# Altium schematic sheet Triggers.SchDoc
size A4
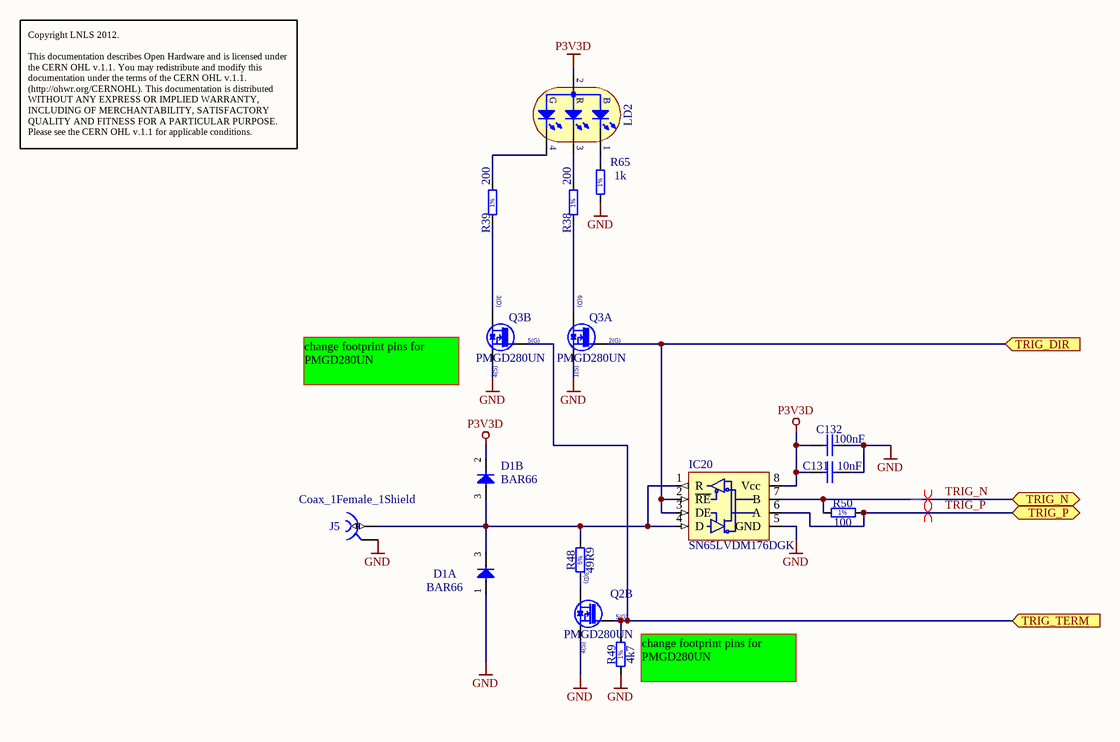
[diagram p0: Triggers.SchDoc]

## Parts
C131  10nF  [CAPC0603X33N]
C132  100nF  [CAPC0603X33N]
D1  BAR66  [SOT95P240X110-3I]  (parts A,B of 2)
IC20  SN65LVDM176DGK  [SOP65P490X110-8N]
J5  Coax_1Female_1Shield  [HUBER-SUHNER_85_MMCX-50-0-1/111 OH]
LD2  (no value)  [LED_AVAGO_HSMF-C113]
Q2  PMGD280UN  [SOT65P210X110-6N]  (part B of 2)
Q3  PMGD280UN  [SOT65P210X110-6N]  (parts A,B of 2)
R38  200  [RESC1005X40N]
R39  200  [RESC1005X40N]
R48  49R9  [RESC3225X70N]
R49  4k7  [RESC1005X40N]
R50  100  [RESC1005X40N]
R65  1k  [RESC1005X40N]

## Ports
TRIG_DIR (in), TRIG_N (bidir), TRIG_P (bidir), TRIG_TERM (in)

## Nets
GND: C131.2 C132.2 D1.1(A) IC20.5(GND) J5.2 Q2.4(S) Q3.1(S) Q3.4(S) R49.1 R65.1
P3V3D: C131.1 C132.1 D1.2(C) IC20.8(Vcc) LD2.2(AC)
TRIG_DIR: IC20.2(~{RE}) IC20.3(DE) Q3.2(G) ; port TRIG_DIR
TRIG_N: IC20.7(B) R50.1 ; port TRIG_N
TRIG_P: IC20.6(A) R50.2 ; port TRIG_P
TRIG_TERM: Q2.5(G) Q3.5(G) R49.2 ; port TRIG_TERM
NetD1_3: D1.3(COMAC) IC20.1(R) IC20.4(D) J5.1 R48.2
NetLD2_1: LD2.1(CB) R65.2
NetLD2_3: LD2.3(CR) R38.2
NetLD2_4: LD2.4(CG) R39.2
NetQ2_3: Q2.3(D) R48.1
NetQ3_3: Q3.3(D) R39.1
NetQ3_6: Q3.6(D) R38.1

## Layout directives
differential pair: TRIG_N, TRIG_P

## Notes on the sheet
- Copyright LNLS 2012.
  This documentation describes Open Hardware and is licensed under the CERN OHL v.1.1. You may redistribute and modify this documentation under the terms of the CERN OHL v.1.1. (http://ohwr.org/CERNOHL). This documentation is distributed WITHOUT ANY EXPRESS OR IMPLIED WARRANTY, INCLUDING OF MERCHANTABILITY, SATISFACTORY QUALITY AND FITNESS FOR A PARTICULAR PURPOSE. Please see the CERN OHL v.1.1 for applicable conditions.
- (near Q3) change footprint pins for PMGD280UN
- (near R49) change footprint pins for PMGD280UN
- (in symbol LED_AVAGO_HSMF-C113) G; R; B
- (in symbol PMGD280UN, part A) 6(D); 2(G); 1(S)
- (in symbol PMGD280UN, part B) 3(D); 5(G); 4(S)
- (in symbol R0402_1K_1%_0.0625W_100PPM) 1%
- (in symbol R0402_4K7_1%_0.0625W_100PPM) 1%
- (in symbol R0402_100R_1%_0.0625W_100PPM) 1%
- (in symbol R0402_200R_1%_0.0625W_100PPM) 1%
- (in symbol R1210_270R_5%_0.5W_200PPM) 5%

## Library data of the parts
C131 = CC0201_10NF_10V_10%_X5R: Non-polarised capacitor; Part Description: SMD Multilayer Chip Ceramic Capacitor; Manufacturer: GENERIC; Manufacturer1 Part Number: 0201ZD103KAT2A; Voltage: 10V; TC: X5R; Tolerance: ±10%; Table: Capacitors SMD; Part Number: CC0201_10NF_10V_10%_X5R; Component Kind: Standard; Component Type: Standard; Pin Count: 2; Value: 10nF; Status: Not Recommended; Manufacturer Part Number: CC0201_10NF_10V_10%_X5R; Case: 0201; Mounted: Yes; Socket: No; SMD: Yes; Manufacturer1 Example: AVX; Manufacturer1 ComponentHeight: 0.33mm; HelpURL: \\cern.ch\dfs\Applications\Altium\Datasheets\CC0201_X5R_AVX.pdf; Author: CERN DEM JLC; CreateDate: 03/12/2007; LatestRevisionDate: 03/12/2007; Sense: No
C132 = CC0201_100NF_6.3V_10%_X5R: Non-polarised capacitor; Part Description: SMD Multilayer Chip Ceramic Capacitor; Manufacturer: GENERIC; Manufacturer1 Part Number: 02016D104KAT2A; Voltage: 6.3V; TC: X5R; Tolerance: ±10%; Table: Capacitors SMD; Part Number: CC0201_100NF_6.3V_10%_X5R; Component Kind: Standard; Component Type: Standard; Pin Count: 2; Value: 100nF; Status: Not Recommended; Manufacturer Part Number: CC0201_100NF_6.3V_10%_X5R; Case: 0201; Mounted: Yes; Socket: No; SMD: Yes; Manufacturer1 Example: AVX; Manufacturer1 ComponentHeight: 0.33mm; HelpURL: \\cern.ch\dfs\Applications\Altium\Datasheets\CC0201_X5R_AVX.pdf; Author: CERN DEM JLC; CreateDate: 03/12/2007; LatestRevisionDate: 03/12/2007; Sense: No
D1 = Diode x2 A1C3_A3C2: Serial Diode; Part Description: Silicon PIN Diode Array (Series Connected); Manufacturer: INFINEON; Voltage: 150V; Power: 250mA; Table: Diodes; Part Number: BAR66; Component Kind: Standard; Component Type: Standard; Device: BAR66; Footprint: SOT95P240X110-3N; PackageDescription: SOT23 3-Leads, Pitch 0.95mm - Body 1.3x2.9mm, IPC Medium Density; Manufacturer Part Number: BAR66; Pin Count: 3; Mounted: Yes; Socket: No; SMD: Yes; ComponentHeight: 1.1mm; HelpURL: C:\TSR\Laurin\Projects\FMC\CERN DAC\Parts\Digital\BAR66.pdf; Author: CERN DEM JLC; CreateDate: 18/01/2010; LatestRevisionDate: 05/10/2010; Case: SOT23
IC20 = SN65LVDM176DGK: Differential Bus Transceiver; Part Description: High Speed Differential Transceiver LVDS/LVTTL; Manufacturer: TEXAS INSTRUMENTS; PressFit: No; Bonding: No; Part Number: SN65LVDM176DGK; Component Kind: Standard; Component Type: Standard; Device: SN65LVDM176DGK; PackageDescription: SOP, 0.65mm pitch; 8 pin, 3.00mm W X 3.00mm L X 1.10mm H body, IPC Medium Density; Manufacturer Part Number: SN65LVDM176DGK; Pin Count: 8; Case: SOP8; Mounted: Yes; Socket: No; SMD: Yes; Sense: No; ComponentHeight: 1.1mm; Author: LNLS DIG GBMB; CreateDate: 28/05/2016; LatestRevisionDate: 28/05/2016
J5 = HUBER-SUHNER_85_MMCX-50-0-1/111 OH: Part Description: MMCX 50 Ohms Right Angle PCB Jack; Manufacturer: HUBER+SUHNER; Table: Miscellaneous; Part Number: HUBER-SUHNER_85_MMCX-50-0-1/111 OH; Component Kind: Standard; Component Type: Standard; Pin Count: 2; Family: MMCX; Mounted: Yes; Socket: No; SMD: No; Status: None; Manufacturer Part Number: 85_MMCX-50-0-1/111 OH; ComponentHeight: 9.6mm; HelpURL: \\cern.ch\dfs\Applications\Altium\Datasheets\HUBER-SUHNER_85_MMCX-50-0-1-111 OH.pdf; Author: CERN DEM JLC; CreateDate: 2011-10-04; LatestRevisionDate: 2011-10-04
LD2 = LED_AVAGO_HSMF-C113: Tricolor LEDs 1 Cathode Blue, 2 Common Anode, 3 Cathode Red, 4 Cathode Green; Part Description: Right Angle Tricolor (Blue, Red, Green) Surface Mount ChipLED; Manufacturer: AVAGO TECHNOLOGIES; Color: Blue/Red/Green; Table: LEDs & Displays; Bonding: No; PressFit: No; Part Number: LED_AVAGO_HSMF-C113; Component Kind: Standard; Component Type: Standard; PackageDescription: Right Angle Tricolor Surface Mount ChipLED, Body 2.5x1mm; Manufacturer Part Number: HSMF-C113; Pin Count: 4; Mounted: Yes; Socket: No; SMD: Yes; ComponentHeight: 1mm; HelpURL: \\cern.ch\dfs\Applications\Altium\Datasheets\LED_AVAGO_HSMF-C113.pdf; Author: CERN DEM JLC; CreateDate: 29/09/2010; LatestRevisionDate: 29/09/2010; Sense: No
Q2 Q3 = PMGD280UN: Dual N-Channel micro TrenchMOS™ Ultra Low Level FET; Manufacturer: NXP SEMICONDUCTORS; Part Description: 20V 870mA Dual N-Channel micro TrenchMOS™ Ultra Low Level FET; Bonding: No; PressFit: No; Part Number: PMGD280UN; Author: CERN DEM JLC; Case: SOT363; ComponentHeight: 1.1mm; Component Type: Standard; CreateDate: 19/11/2014; Device: PMGD280UN; HelpURL: \\cern.ch\dfs\Applications\Altium\Datasheets\PMGD280UN.pdf; LatestRevisionDate: 19/11/2014; Manufacturer Part Number: PMGD280UN; Mounted: Yes; PackageDescription: SOT363, SC70-6, SOT, 0.65mm Pitch, 6 pin, 1.25mm W X 2.00mm L X 1.10mm H, IPC Medium Density; Pin Count: 6; Sense: No; SMD: Yes; Socket: No
R38 R39 = R0402_200R_1%_0.0625W_100PPM: Resistor - 1%; Part Description: General Purpose Thick Film Chip Resistor; Manufacturer: GENERIC; Manufacturer1 Part Number: 232270672001L; TC: ±100ppm/°C; Table: Resistors SMD; Part Number: R0402_200R_1%_0.0625W_100PPM; Component Kind: Standard; Component Type: Standard; Pin Count: 2; Value: 200; Status: Not recommended; Power: 0.0625W; Tolerance: ±1%; Manufacturer Part Number: R0402_200R_1%_0.0625W_100PPM; Case: 0402; Mounted: Yes; Socket: No; SMD: Yes; Manufacturer1 Example: YAGEO PHYCOMP; Manufacturer1 ComponentHeight: 0.4mm; HelpURL: \\cern.ch\dfs\Applications\Altium\Datasheets\R0402_Phycomp_RC0402.pdf; Author: CERN DEM JLC; CreateDate: 03/12/2007; LatestRevisionDate: 17/10/2012; Sense: No
R48 = R1210_270R_5%_0.5W_200PPM: Resistor - 5%; Part Number: R1210_49R9_1%_0.33W_100PPM; Part Description: General Purpose Thick Film Chip Resistor; Manufacturer: VISHAY; Manufacturer Part Number: CRCW121049R9FK; Power: 0.33W; TC: ±100ppm/°C; Table: Resistors SMD; Component Kind: Standard; Component Type: Standard; Pin Count: 2; Value: 49R9; Status: None; Tolerance: ±5%; Case: 1210; Mounted: Yes; Socket: No; SMD: Yes; ComponentHeight: 0.7mm; HelpURL: \\cern.ch\dfs\Applications\Altium\Datasheets\R1210_PANASONIC_ERJ.pdf; Author: CERN DEM JLC; CreateDate: 2011-10-26; LatestRevisionDate: 2011-10-26
R49 = R0402_4K7_1%_0.0625W_100PPM: Resistor - 1%; Part Description: General Purpose Thick Film Chip Resistor; Manufacturer: GENERIC; Manufacturer1 Part Number: 232270674702L; TC: ±100ppm/°C; Table: Resistors SMD; Part Number: R0402_4K7_1%_0.0625W_100PPM; Component Kind: Standard; Component Type: Standard; Pin Count: 2; Value: 4k7; Status: Not recommended; Power: 0.0625W; Tolerance: ±1%; Manufacturer Part Number: R0402_4K7_1%_0.0625W_100PPM; Case: 0402; Mounted: Yes; Socket: No; SMD: Yes; Manufacturer1 Example: YAGEO PHYCOMP; Manufacturer1 ComponentHeight: 0.4mm; HelpURL: \\cern.ch\dfs\Applications\Altium\Datasheets\R0402_Phycomp_RC0402.pdf; Author: CERN DEM JLC; CreateDate: 03/12/2007; LatestRevisionDate: 17/10/2012; Sense: No
R50 = R0402_100R_1%_0.0625W_100PPM: Resistor - 1%; Part Description: General Purpose Thick Film Chip Resistor; Manufacturer: GENERIC; Manufacturer1 Part Number: 232270671001L; TC: ±100ppm/°C; Table: Resistors SMD; Part Number: R0402_100R_1%_0.0625W_100PPM; Component Kind: Standard; Component Type: Standard; Pin Count: 2; Value: 100; Status: Not recommended; Power: 0.0625W; Tolerance: ±1%; Manufacturer Part Number: R0402_100R_1%_0.0625W_100PPM; Case: 0402; Mounted: Yes; Socket: No; SMD: Yes; Manufacturer1 Example: YAGEO PHYCOMP; Manufacturer1 ComponentHeight: 0.4mm; HelpURL: \\cern.ch\dfs\Applications\Altium\Datasheets\R0402_Phycomp_RC0402.pdf; Author: CERN DEM JLC; CreateDate: 03/12/2007; LatestRevisionDate: 17/10/2012; Sense: No
R65 = R0402_1K_1%_0.0625W_100PPM: Resistor - 1%; Part Description: General Purpose Thick Film Chip Resistor; Manufacturer: GENERIC; Manufacturer1 Part Number: 232270671002L; TC: ±100ppm/°C; Table: Resistors SMD; Part Number: R0402_1K_1%_0.0625W_100PPM; Component Kind: Standard; Component Type: Standard; Pin Count: 2; Value: 1k; Status: Not recommended; Power: 0.0625W; Tolerance: ±1%; Manufacturer Part Number: R0402_1K_1%_0.0625W_100PPM; Case: 0402; Mounted: Yes; Socket: No; SMD: Yes; Manufacturer1 Example: YAGEO PHYCOMP; Manufacturer1 ComponentHeight: 0.4mm; HelpURL: \\cern.ch\dfs\Applications\Altium\Datasheets\R0402_Phycomp_RC0402.pdf; Author: CERN DEM JLC; CreateDate: 03/12/2007; LatestRevisionDate: 17/10/2012; Sense: No